# Altium schematic sheet atWork_Power.SchDoc
size A3
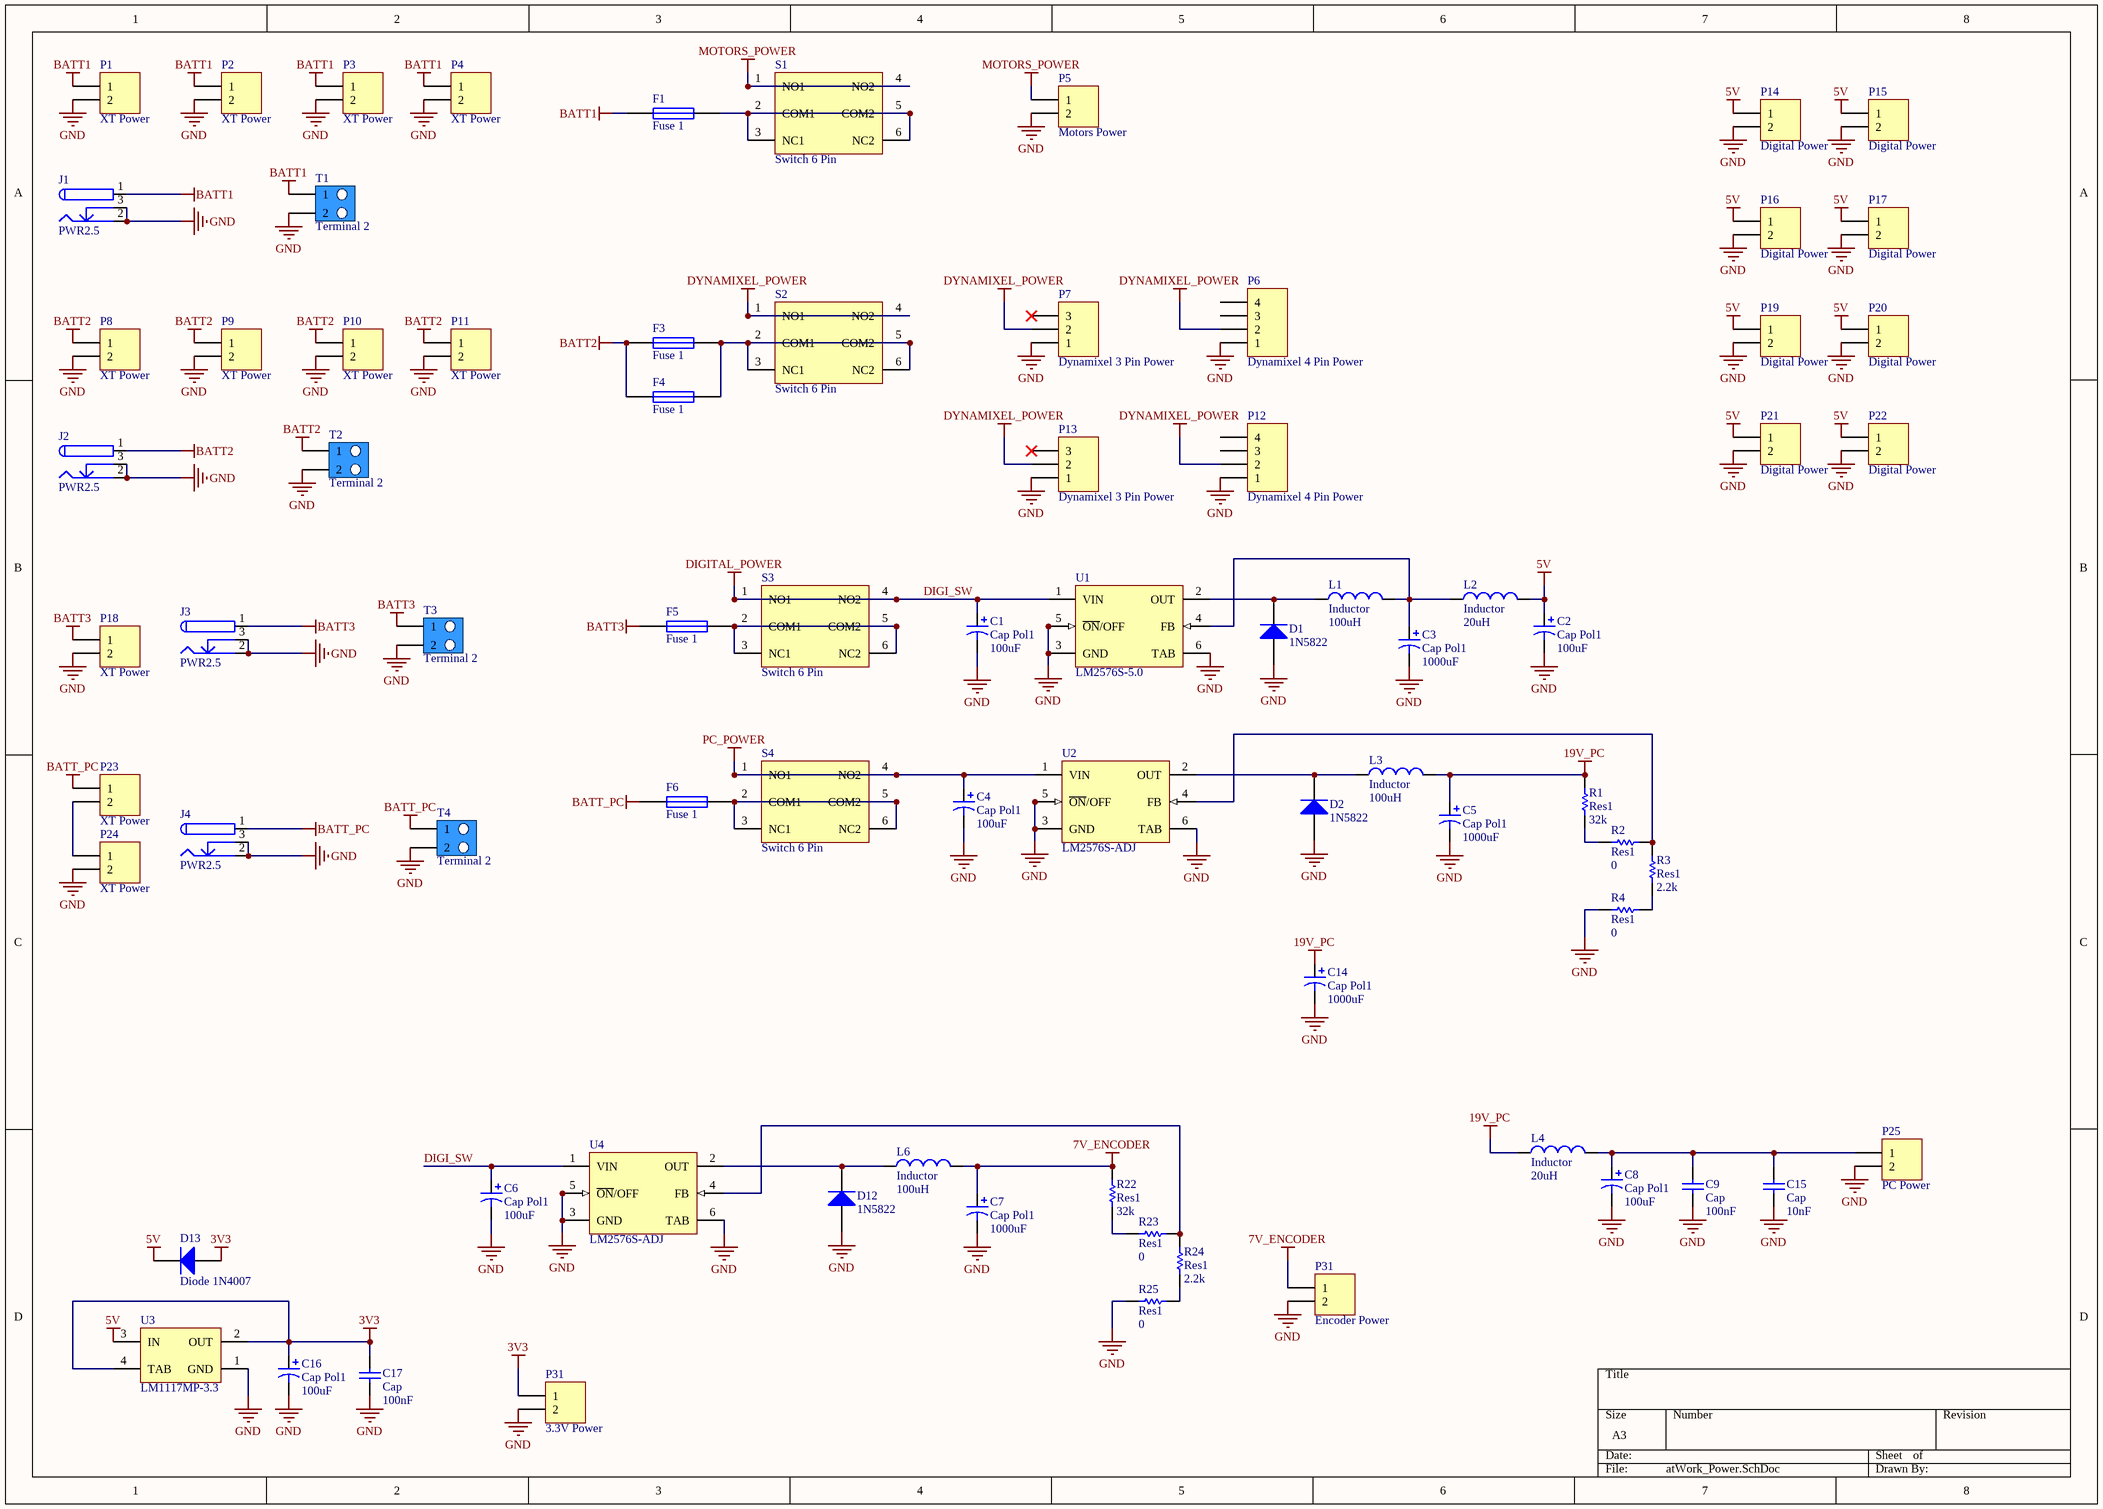
[diagram p0: atWork_Power.SchDoc]

## Parts
(Parts that share a designator on the sheet are numbered #1, #2 ... from top to bottom, then left to right.)
C1  Cap Pol1  value 100uF  [CAP-SMD2]
C2  Cap Pol1  value 100uF  [CAP-SMD2]
C3  Cap Pol1  value 1000uF  [CAP2]
C4  Cap Pol1  value 100uF  [CAP-SMD2]
C5  Cap Pol1  value 1000uF  [CAP2]
C6  Cap Pol1  value 100uF  [CAP-SMD2]
C7  Cap Pol1  value 1000uF  [CAP2]
C8  Cap Pol1  value 100uF  [CAP-SMD2]
C9  Cap  value 100nF  [C1206]
C14  Cap Pol1  value 1000uF  [CAP2]
C15  Cap  value 10nF  [C1206]
C16  Cap Pol1  value 100uF  [CAP-SMD1]
C17  Cap  value 100nF  [C1206]
D1  1N5822  [DIODE-SMD]
D2  1N5822  [DIODE-SMD]
D12  1N5822  [DIODE-SMD]
D13  Diode 1N4007  [DIODE-SMD]
F1  Fuse 1  [FUSE]
F3  Fuse 1  [FUSE]
F4  Fuse 1  [FUSE]
F5  Fuse 1  [FUSE]
F6  Fuse 1  [FUSE]
J1  PWR2.5  [PWR2.5]
J2  PWR2.5  [PWR2.5]
J3  PWR2.5  [PWR2.5]
J4  PWR2.5  [PWR2.5]
L1  Inductor  value 100uH  [IND2]
L2  Inductor  value 20uH  [IND1]
L3  Inductor  value 100uH  [IND2]
L4  Inductor  value 20uH  [IND1]
L6  Inductor  value 100uH  [IND2]
P1  XT Power  [XT]
P2  XT Power  [XT]
P3  XT Power  [XT]
P4  XT Power  [XT]
P5  Motors Power  [POWER2PIN]
P6  Dynamixel 4 Pin Power  [XH4PIN]
P7  Dynamixel 3 Pin Power  [XH3PIN]
P8  XT Power  [XT]
P9  XT Power  [XT]
P10  XT Power  [XT]
P11  XT Power  [XT]
P12  Dynamixel 4 Pin Power  [XH4PIN]
P13  Dynamixel 3 Pin Power  [XH3PIN]
P14  Digital Power  [XH2PIN]
P15  Digital Power  [XH2PIN]
P16  Digital Power  [XH2PIN]
P17  Digital Power  [XH2PIN]
P18  XT Power  [XT]
P19  Digital Power  [XH2PIN]
P20  Digital Power  [XH2PIN]
P21  Digital Power  [XH2PIN]
P22  Digital Power  [XH2PIN]
P23  XT Power  [XT]
P24  XT Power  [XT]
P25  PC Power  [POWER2PIN]
P31#1  Encoder Power  [XH2PIN]
P31#2  3.3V Power  [XH2PIN]
R1  Res1  value 32k  [C1206]
R2  Res1  value 0  [C1206]
R3  Res1  value 2.2k  [C1206]
R4  Res1  value 0  [C1206]
R22  Res1  value 32k  [C1206]
R23  Res1  value 0  [C1206]
R24  Res1  value 2.2k  [C1206]
R25  Res1  value 0  [C1206]
S1  Switch 6 Pin  [SW6PIN]
S2  Switch 6 Pin  [SW6PIN]
S3  Switch 6 Pin  [SW6PIN]
S4  Switch 6 Pin  [SW6PIN]
T1  Terminal 2  [TERMINAL2PIN]
T2  Terminal 2  [TERMINAL2PIN]
T3  Terminal 2  [TERMINAL2PIN]
T4  Terminal 2  [TERMINAL2PIN]
U1  LM2576S-5.0  [TS5B_M]
U2  LM2576S-ADJ  [TS5B_M]
U3  LM1117MP-3.3  [MP04A_M]
U4  LM2576S-ADJ  [TS5B_M]

## Nets
3V3: C16.1 C17.2 D13.1(A) P31#2.1 U3.2(OUT) U3.4(TAB)
5V: C2.1 D13.2(K) L2.2 P14.1 P15.1 P16.1 P17.1 P19.1 P20.1 P21.1 P22.1 U3.3(IN)
7V_ENCODER: C7.1 L6.2 P31#1.1 R22.1
19V_PC: C5.1 C14.1 L3.2 L4.1 R1.1
BATT1: F1.1 J1.1 P1.1 P2.1 P3.1 P4.1 T1.1
BATT2: F3.1 F4.1 J2.1 P8.1 P9.1 P10.1 P11.1 T2.1
BATT3: F5.1 J3.1 P18.1 T3.1
BATT_PC: F6.1 J4.1 P23.1 T4.1
DIGI_SW: C1.1 C6.1 S3.1(NO1) S3.4(NO2) U1.1(VIN) U4.1(VIN)  [also labelled DIGITAL_POWER]
DYNAMIXEL_POWER: P6.2 P7.2 P12.2 P13.2 S2.1(NO1) S2.4(NO2)
GND: C1.2 C2.2 C3.2 C4.2 C5.2 C6.2 C7.2 C8.2 C9.1 C14.2 C15.1 C16.2 C17.1 D1.1(A) D2.1(A) D12.1(A) J1.2 J1.3 J2.2 J2.3 J3.2 J3.3 J4.2 J4.3 P1.2 P2.2 P3.2 P4.2 P5.2 P6.1 P7.1 P8.2 P9.2 P10.2 P11.2 P12.1 P13.1 P14.2 P15.2 P16.2 P17.2 P18.2 P19.2 P20.2 P21.2 P22.2 P24.2 P25.2 P31#1.2 P31#2.2 R4.1 R25.1 T1.2 T2.2 T3.2 T4.2 U1.3(GND) U1.5(~{ON}/OFF) U1.6(TAB) U2.3(GND) U2.5(~{ON}/OFF) U2.6(TAB) U3.1(GND) U4.3(GND) U4.5(~{ON}/OFF) U4.6(TAB)
MOTORS_POWER: P5.1 S1.1(NO1) S1.4(NO2)
PC_POWER: C4.1 S4.1(NO1) S4.4(NO2) U2.1(VIN)
NetC3_1: C3.1 L1.2 L2.1 U1.4(FB)
NetC8_1: C8.1 C9.2 C15.2 L4.2 P25.1
NetD1_2: D1.2(K) L1.1 U1.2(OUT)
NetD2_2: D2.2(K) L3.1 U2.2(OUT)
NetD12_2: D12.2(K) L6.1 U4.2(OUT)
NetF1_2: F1.2 S1.2(COM1) S1.3(NC1) S1.5(COM2) S1.6(NC2)
NetF3_2: F3.2 F4.2 S2.2(COM1) S2.3(NC1) S2.5(COM2) S2.6(NC2)
NetF5_2: F5.2 S3.2(COM1) S3.3(NC1) S3.5(COM2) S3.6(NC2)
NetF6_2: F6.2 S4.2(COM1) S4.3(NC1) S4.5(COM2) S4.6(NC2)
NetP23_2: P23.2 P24.1
NetR1_2: R1.2 R2.1
NetR2_2: R2.2 R3.1 U2.4(FB)
NetR3_2: R3.2 R4.2
NetR22_2: R22.2 R23.1
NetR23_2: R23.2 R24.1 U4.4(FB)
NetR24_2: R24.2 R25.2

Not connected (* = marked no-connect by the designer): P6 3 4; P7 3*; P12 3 4; P13 3*

## Library data of the parts
C1-C8 C14 C16 = Cap Pol1: Polarized Capacitor (Radial); Published: 8-Jun-2000; LatestRevisionDate: 17-Jul-2002; LatestRevisionNote: Re-released for DXP Platform.; PackageReference: RB7.6-15; Publisher: Altium Limited; PackageDescription: Polarized Capacitor (Radial); 2 Leads
C9 C15 C17 = Cap: Capacitor; Published: 8-Jun-2000; LatestRevisionDate: 17-Jul-2002; LatestRevisionNote: Re-released for DXP Platform.; PackageReference: RAD-0.3; Publisher: Altium Limited; PackageDescription: Radial Cap, Thru-Hole; 2 Leads; 0.3 in Pin Spacing
D1 D2 D12 = Diode: Default Diode; Published: 8-Jun-2000; LatestRevisionDate: 17-Jul-2002; LatestRevisionNote: Re-released for DXP Platform.; PackageVersion: Sep-1996; PackageReference: SMC; Publisher: Altium Limited; PackageDescription: DO-214-AB/SMC; 2 C-Bend Leads; Body 7.9 x 5.9 mm, inc. leads (LxW); Code_JEDEC: DO-214-AB
D13 = Diode 1N4007: 1 Amp General Purpose Rectifier; Published: 8-Jun-2000; LatestRevisionDate: 17-Jul-2002; LatestRevisionNote: Re-released for DXP Platform.; DatasheetVersion: 1998; PackageVersion: Aug-1999; PackageReference: DO-41; Publisher: Altium Limited; PackageDescription: Diode, Axial; Body 5.2 x 2.7 mm (LxDia. max), Lead Dia. 0.86 mm (max); Code_JEDEC: DO-204-AL; ComponentLink1Description: Manufacturer Link; ComponentLink1URL: http://www.fairchildsemi.com/; ComponentLink2Description: Datasheet; ComponentLink2URL: http://www.fairchildsemi.com/ds/1N%2F1N4001.pdf
F1 F3-F6 = Fuse 1: Fuse; Published: 8-Jun-2000; LatestRevisionDate: 17-Jul-2002; LatestRevisionNote: Re-released for DXP Platform.; PackageReference: PIN-W2/E2.8; Publisher: Altium Limited; PackageDescription: Thru-Hole; 2 Leads
J1-J4 = PWR2.5: Low Voltage Power Supply Connector; Published: 17-Dec-2003; DatasheetDocument: 09-May-2002; Publisher: Altium Limited; ComponentLink1Description: Manufacturer Link; ComponentLink1URL: http://domino.kycon.com/internet/Products.html
L1-L4 L6 = Inductor: Code_IEC: 1005; Published: 8-Jun-2000; LatestRevisionDate: 29-May-2009; LatestRevisionNote: IPC-7351 Footprint Added.; PackageReference: 0402-A; Publisher: Altium Limited; PackageDescription: Chip Inductor; Code_JEITA: 0402
P1-P5 P8-P11 P14-P25 P31#1 P31#2 = Header 2: Header, 2-Pin; LatestRevisionDate: 17-Jul-2002; LatestRevisionNote: Re-released for DXP Platform.; Publisher: Altium Limited
P6 P12 = Header 4: Header, 4-Pin; LatestRevisionDate: 17-Jul-2002; LatestRevisionNote: Re-released for DXP Platform.; Publisher: Altium Limited
P7 P13 = Header 3: Header, 3-Pin; LatestRevisionDate: 17-Jul-2002; LatestRevisionNote: Re-released for DXP Platform.; Publisher: Altium Limited
R1-R4 R22-R25 = Res1: Resistor; Published: 8-Jun-2000; LatestRevisionDate: 17-Jul-2002; LatestRevisionNote: Re-released for DXP Platform.; PackageReference: AXIAL-0.3; Publisher: Altium Limited; PackageDescription: Axial Device, Thru-Hole; 2 Leads; 0.3 in Pin Spacing
S1-S4 = Switch 6 Pin: Designer: Meysam Parvizi; Email: meysam.parvizi.ir@gmail.com; Weblog: http://mp.tabin.ir
T1-T4 = Terminal 2: Terminal, 2 pin; Designer: Meysam Parvizi; Email: meysam.parvizi.ir@gmail.com; Weblog: http://mp.tabin.ir
U1 = LM2576S-5.0: SIMPLE SWITCHER® 3A Step-Down Voltage Regulator, 5-pin TO-263; Manufacturer: National Semiconductor; PackageTopMarking: NSUZXYTTE#*LM2576S*-5.0 P+; PowerWise: N; Published: 4-Dec-2008; DatasheetVersion: Aug-2004; PackageVersion: revD, Apr-2005; PackageReference: TS5B; Publisher: Altium Limited; PackageDescription: TO-263, Molded, .400 x .390 x .180in, 5 Lead, .067in Pitch, Surface Mount; PartNumber: LM2576S-5.0; RoHS: N; PinCount: 5; CompType: Switcher; Code_JEDEC: MO-169-AB; ComponentLink1Description: LM2576 Datasheet; ComponentLink1URL: http://www.national.com/ds/LM/LM2576.pdf; ComponentLink2Description: LM2576 Web Page; ComponentLink2URL: http://www.national.com/pf/LM/LM2576.html; ComponentLink3Description: TS5B Package Page; ComponentLink3URL: http://www.national.com/packaging/folders/ts5b.html
U2 U4 = LM2576S-ADJ: SIMPLE SWITCHER® 3A Step-Down Voltage Regulator, 5-pin TO-263; Manufacturer: National Semiconductor; PackageTopMarking: NSUZXYTTE#*LM2576S*-ADJ P+; PowerWise: N; Published: 4-Dec-2008; DatasheetVersion: Aug-2004; PackageVersion: revD, Apr-2005; PackageReference: TS5B; Publisher: Altium Limited; PackageDescription: TO-263, Molded, .400 x .390 x .180in, 5 Lead, .067in Pitch, Surface Mount; PartNumber: LM2576S-ADJ; RoHS: N; PinCount: 5; CompType: Switcher; Code_JEDEC: MO-169-AB; ComponentLink1Description: LM2576 Datasheet; ComponentLink1URL: http://www.national.com/ds/LM/LM2576.pdf; ComponentLink2Description: LM2576 Web Page; ComponentLink2URL: http://www.national.com/pf/LM/LM2576.html; ComponentLink3Description: TS5B Package Page; ComponentLink3URL: http://www.national.com/packaging/folders/ts5b.html
U3 = LM1117MP-3.3: 800mA Low-Dropout Linear Regulator, 4-pin SOT-223; Manufacturer: National Semiconductor; PackageTopMarking: XYTT*N05A; PowerWise: N; CompType: LDO IC; Published: 4-Dec-2008; DatasheetVersion: Apr-2006; PackageVersion: revB, Apr-2003; PackageReference: MP04A; Publisher: Altium Limited; PackageDescription: Molded SOT-223, 6.50 x 3.56 x 1.6mm Body, 4 Lead, 2.3mm Pitch; Supplier 1: Farnell; Supplier Part Number 1: 9778195; Supplier 2: Farnell; Supplier Part Number 2: 9778195RL; PartNumber: LM1117MP-3.3; RoHS: N; PinCount: 4; Code_JEDEC: TO-261-AA; Code_IPC: SOT223-4; ComponentLink1Description: LM1117 Datasheet; ComponentLink1URL: http://www.national.com/ds/LM/LM1117.pdf; ComponentLink2Description: LM1117 Web Page; ComponentLink2URL: http://www.national.com/pf/LM/LM1117.html; ComponentLink3Description: MP04A Package Page; ComponentLink3URL: http://www.national.com/packaging/folders/mp04a.html